# Altium project SSR_MODULE.PrjPCB
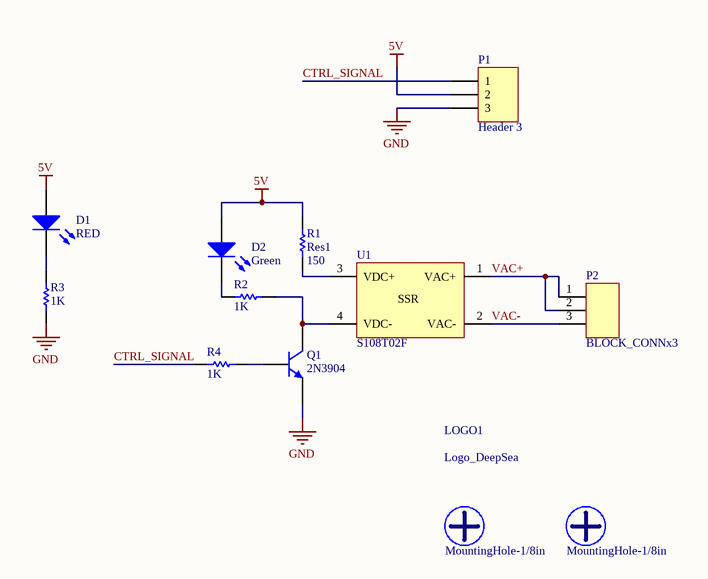
[diagram p0: SSR_MODULE.SchDoc]
1 sheet, 13 parts. Net scope: global (net labels, ports and power ports of the same name join across sheets).
Board file: SSR_MODULE.PcbDoc

## Sheet SSR_MODULE.SchDoc
size A4

### Parts
*1  MountingHole-1/8in  [MoutingHole-1/8in]
*2  MountingHole-1/8in  [MoutingHole-1/8in]
D1  RED  [R0603_L]
D2  Green  [R0603_L]
LOGO1  Logo_DeepSea  [DeepSea_logo1]
P1  Header 3  [HDR1X3]
P2  BLOCK_CONNx3  [BLOCK_CONNx3]
Q1  2N3904  [TO-92A]
R1  Res1  value 150  [AXIAL-0.3]
R2  value 1K  [R0603_L]  (hidden comment: R_SMD)
R3  value 1K  [R0603_L]  (hidden comment: R_SMD)
R4  value 1K  [R0603_L]  (hidden comment: R_SMD)
U1  S108T02F  [ZC_4-ZSIP]

### Nets
5V: D1.1(A) D2.1(A) P1.2 R1.2
GND: P1.3 Q1.1(E) R3.2
CTRL_SIGNAL: P1.1 R4.2
VAC+: P2.1 P2.2 U1.1(VAC+)
VAC-: P2.3 U1.2(VAC-)
NetD1_2: D1.2(K) R3.1
NetD2_2: D2.2(K) R2.2
NetQ1_2: Q1.2(B) R4.1
NetQ1_3: Q1.3(C) R2.1 U1.4(VDC-)
NetR1_1: R1.1 U1.3(VDC+)

### Notes on the sheet
- (in symbol S108T02F) SSR

### Library data of the parts
D1 D2 = LED_SMD
  D1: Color: RED
  D2: Color: Green
P1 = Header 3: Header, 3-Pin; LatestRevisionDate: 17-Jul-2002; LatestRevisionNote: Re-released for DXP Platform.; Publisher: Altium Limited
P2 = BLOCK_CONNx3: TERM BLOCK 5.08MM VERT 3POS PCB; Manufacturer: On Shore Technology Inc; Manufacturer Part Number: OSTTC032162; Number of Levels: 1; Positions Per Level: 3; Pitch: 0.200" (5.08mm); Mating Orientation: Horizontal with Board; Current: 15A; Voltage: 300V; Wire Gauge: 14-22 AWG; Wire Termination: Screw - Leaf Spring, Wire Guard; Clamp Material - Plating: Steel, Stainless; Screw Material - Plating: Steel - Zinc Plated; Torque - Screw: 0.3 Nm (2.6 Lb-In); Screw Thread: M2.6; Supplier 1: Digi-Key; RoHS: RoHS Compliant; Category: Connectors, Interconnects; Stock 1: 4040; Pricing 1: 1=0.51, 10=0.48, 50=0.384, 100=0.368, 250=0.336, 500=0.32, 1000=0.264, 2500=0.24, 5000=0.232 (USD); Packaging: Bulk; Mounting Type: Through Hole; Features: Interlocking (Side); Color: Blue; Operating Temperature: -30°C ~ 105°C; Housing Material: Thermoplastic; Contact Material - Plating: Tin Plated; ComponentLink1URL: http://www.on-shore.com/sites/default/files/manuals/osttcxx2162.pdf; ComponentLink1Description: http://www.on-shore.com/sites/default/files/manuals/osttcxx2162.pdf; Supplier Part Number 1: ED2610-ND
Q1 = 2N3904: NPN General Purpose Amplifier; Published: 8-Jun-2000; LatestRevisionDate: 15-Jan-2003; LatestRevisionNote: PCB Footprint 'BCY-W3/D4.7' replaced; DatasheetVersion: 1997; PackageVersion: Sep-1998; PackageReference: TO-92A; Publisher: Altium Limited; PackageDescription: TO, Flat Index; 3 In-Line, Axial Leads; Body Dia. 4.5mm; Leads 0.51 x 0.48 mm (max); ComponentLink1Description: Manufacturer Link; ComponentLink1URL: http://www.fairchildsemi.com/; ComponentLink2Description: Datasheet; ComponentLink2URL: http://www.fairchildsemi.com/ds/2N%2F2N3904.pdf
R1 = Res1: Resistor; Published: 8-Jun-2000; LatestRevisionDate: 17-Jul-2002; LatestRevisionNote: Re-released for DXP Platform.; PackageReference: AXIAL-0.3; Publisher: Altium Limited; PackageDescription: Axial Device, Thru-Hole; 2 Leads; 0.3 in Pin Spacing
U1 = S108T02F: RELAY SSR 120VAC 8A ZC 4-SIP; Manufacturer: Sharp Microelectronics; Circuit: SPST-NO (1 Form A); Output Type: AC, Zero Cross; Voltage - Input: 1.2VDC; Voltage - Load: 80 ~ 120 V; Supplier 1: Digi-Key; Manufacturer Part Number: S108T02F; RoHS: RoHS Compliant; Category: Relays; Stock 1: 919; Pricing 1: 1=5.1, 10=4.08, 25=3.876, 100=3.366, 500=2.958, 750=2.7948, 1000=2.652, 2500=2.55, 5000=2.4888 (USD); Packaging: Tube; On-State Resistance: -; Load Current: 8A; Mounting Type: Through Hole; Termination Style: PC Pin; Package / Case: 4-SIP; Supplier Device Package: 4-SIP; Relay Type: Relay; ComponentLink1URL: http://www.sharpsma.com/webfm_send/315; ComponentLink1Description: http://www.sharpsma.com/webfm_send/315; Supplier Part Number 1: 425-2396-5-ND